# Altium schematic sheet power.SchDoc
size A4; SheetNumber: 4; SheetTotal: 4
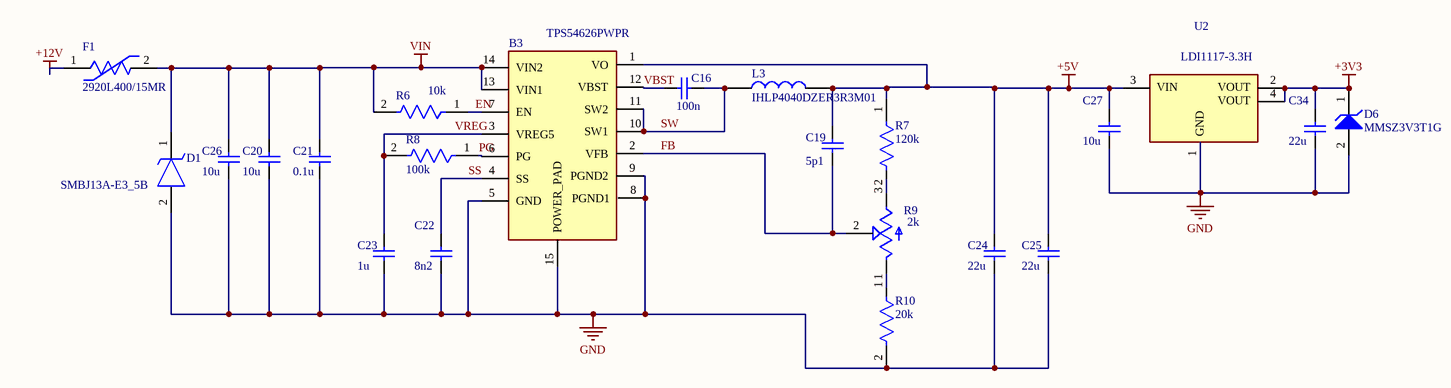
[diagram p0: power.SchDoc]

## Parts
B3  TPS54626PWPR  [TPS54626PWPR]
C16  100n  [CAPC1206(3216)150_L]
C19  5p1  [CAPC1206(3216)150_L]
C20  10u  [CAPC1206(3216)150_L]
C21  0.1u  [CAPC1206(3216)150_L]
C22  8n2  [CAPC1206(3216)150_L]
C23  1u  [CAPC1206(3216)150_L]
C24  22u  [CAPC1206(3216)150_L]
C25  22u  [CAPC1206(3216)150_L]
C26  10u  [CAPC1206(3216)150_L]
C27  10u  [CAPC1206(3216)150_L]
C34  22u  [CAPC1206(3216)150_L]
D1  SMBJ13A-E3_5B  [DIOM5436X244N]
D6  MMSZ3V3T1G  [ONSC-SOD-123-2-425-04_V]
F1  2920L400/15MR  [FP-2920L400-15MR-MFG]
L3  IHLP4040DZER3R3M01  [IHLP4040DZER3R3M01]
R6  10k  [FP-RK73H2B-MFG]
R7  120k  [FP-RK73H2B-MFG]
R8  100k  [FP-RK73H2B-MFG]
R9  2k  [TRIM_TC33X-2-503E]
R10  20k  [FP-RK73H2B-MFG]
U2  LDI1117-3.3H  [LDI1117-3.3H]

## Nets
+3V3: C34.1 D6.1(K) U2.2 U2.4
+5V: B3.1(VO) C19.1 C24.1 C25.1 C27.1 L3.2 R7.1 U2.3
+12V: F1.1
GND: B3.5(GND) B3.8(PGND1) B3.9(PGND2) B3.15(POWER_PAD) C20.2 C21.2 C22.2 C23.2 C24.2 C25.2 C26.2 C27.2 C34.2 D1.2(A) D6.2(A) R10.2 U2.1
VIN: B3.13(VIN1) B3.14(VIN2) C20.1 C21.1 C26.1 D1.1(K) F1.2 R6.2
EN: B3.7(EN) R6.1
FB: B3.2(VFB) C19.2 R9.2(W)
PG: B3.6(PG) R8.1
SS: B3.4(SS) C22.1
SW: B3.10(SW1) B3.11(SW2) C16.2 L3.1
VBST: B3.12(VBST) C16.1
VREG: B3.3(VREG5) C23.1 R8.2
NetR7_2: R7.2 R9.3(CW)
NetR9_1: R9.1(CCW) R10.1

## Notes on the sheet
- (in symbol LDI1117-3.3H) VIN; VOUT; GND

## Library data of the parts
B3 = TPS54626PWPR: 4.5-V to 18-V, 6.5-A synchronous buck converter with eco-mode in HTSSOP package 14-HTSSOP -40 to 85; Manufacturer_Name: Texas Instruments; Manufacturer Lifecycle Status: ACTIVE; Geometry.Height: 1.2mm; Max Supply Voltage: 18V; Max Junction Temperature (Tj): 150°C; Max Output current: 6.5A; Max Output Voltage: 5.5V; Min Input Voltage: 4.5V; Min Output Voltage: 765mV; Number of Outputs: 1; Output Configuration: Positive; Output Type: Adjustable; Quiescent Current: 950µA; Switching Frequency: 650kHz; Synchronous Rectifier: Yes; Manufacturer_Part_Number: TPS54626PWPR; Mouser Part Number: 595-TPS54626PWPR; Mouser Price/Stock: https://www.mouser.com/Search/Refine.aspx?Keyword=595-TPS54626PWPR; Arrow Part Number: TPS54626PWPR; Arrow Price/Stock: https://www.arrow.com/en/products/tps54626pwpr/texas-instruments; Datasheet Link: http://www.ti.com/lit/gpn/tps54626; Supplier: DigiKey; Supplier Part Number: 296-40807-1-ND; Manufacturer: Texas Instruments; Manufacturer Part Number: TPS54626PWPR; RoHS: Compliant; Category: Voltage Regulators - Switching; Stock: 2008; Pricing: 1=2,62, 10=1,949, 25=1,7824, 100=1,5986, 250=1,511, 500=1,45818, 1000=1,41471 (USD); Case/Package: SOP; Height: 1.2mm; Lead Free: Lead Free; Length: 5mm; Lifecycle Status: Production; Max Operating Temperature: 85°C; Min Operating Temperature: -40°C; Min Supply Voltage: 4.5V; Mounting Technology: Surface Mount; Pins: 14; Operating Supply Voltage: 18V; Output Current: 6.5A; Output Voltage: 5.5V; Packaging: Tape & Reel (TR); Radiation Hardening: No; Schedule B: 8542390000, 8542390000|8542390000|8542390000|8542390000|8542390000; Thickness: 1mm; Topology: Buck; Weight: 240.999296mg; Width: 4.4mm; ComponentLink1URL: https://sigma.octopart.com:443/159569814/technical_drawing/Texas-Instruments-TPS54626PWPR.pdf?src-supplier=Texas+Instruments; ComponentLink1Description: https://sigma.octopart.com:443/159569814/technical_drawing/Texas-Instruments-TPS54626PWPR.pdf?src-supplier=Texas+Instruments; ComponentLink2URL: https://octopart.com:443/opatz8j6/c1?t=junKIVYlBbJDuToYkP2u6iV_naOc3Ho3DaOgm-CZ1UNwzrO6Mwyt4_bqvjuo9VmmQwBrWZSgc4LMoLaqIUkSz1Xp0i9S1rGYecaLkVbwuYCFoHmPHRnGPZOeqL-psw5WJA7ukYFP-z3UDe3vNSZVHaSS5TxmzYc38o1a76CPyg8DfEPdGkibNetDDoh0UPz4M4fSBrk37deijP5Y4U2a4nCx67PN7G5YxWzDYRetJGeVH0J_jhwrCM2X4qBFoA_wruu_NjKBHA4DIZrHf9JZLVDCNqpVByfdRJxT7EWUiLr8Dj5AnH3Xy44ZP455MYbgrmSiHAkyMUWlRSGl12e9NFk8w0cDAeKGDR43UxISDxcxxqmRqcKUGnIReVBdDrWwUstg4jH0&src-supplier=Texas+Instruments; ComponentLink2Description: https://octopart.com:443/opatz8j6/c1?t=junKIVYlBbJDuToYkP2u6iV_naOc3Ho3DaOgm-CZ1UNwzrO6Mwyt4_bqvjuo9VmmQwBrWZSgc4LMoLaqIUkSz1Xp0i9S1rGYecaLkVbwuYCFoHmPHRnGPZOeqL-psw5WJA7ukYFP-z3UDe3vNSZVHaSS5TxmzYc38o1a76CPyg8DfEPdGkibNetDDoh0UPz4M4fSBrk37deijP5Y4U2a4nCx67PN7G5YxWzDYRetJGeVH0J_jhwrCM2X4qBFoA_wruu_NjKBHA4DIZrHf9JZLVDCNqpVByfdRJxT7EWUiLr8Dj5AnH3Xy44ZP455MYbgrmSiHAkyMUWlRSGl12e9NFk8w0cDAeKGDR43UxISDxcxxqmRqcKUGnIReVBdDrWwUstg4jH0&src-supplier=Texas+Instruments; ComponentLink3URL: https://datasheet.octopart.com:443/TPS54626PWPR-Texas-Instruments-datasheet-20674354.pdf?src-supplier=Texas+Instruments; ComponentLink3Description: https://datasheet.octopart.com:443/TPS54626PWPR-Texas-Instruments-datasheet-20674354.pdf?src-supplier=Texas+Instruments; ComponentLink4URL: https://datasheet.octopart.com:443/TPS54626PWPR-Texas-Instruments-datasheet-17275025.pdf?src-supplier=Texas+Instruments; ComponentLink4Description: https://datasheet.octopart.com:443/TPS54626PWPR-Texas-Instruments-datasheet-17275025.pdf?src-supplier=Texas+Instruments; ComponentLink5URL: https://sigma.octopart.com:443/49250594/technical_drawing/Texas-Instruments-TPS54626PWPR.pdf?src-supplier=Texas+Instruments; ComponentLink5Description: https://sigma.octopart.com:443/49250594/technical_drawing/Texas-Instruments-TPS54626PWPR.pdf?src-supplier=Texas+Instruments; ComponentLink6URL: https://datasheet.octopart.com:443/TPS54626PWPR-Texas-Instruments-datasheet-164392911.pdf?src-supplier=LCSC; ComponentLink6Description: https://datasheet.octopart.com:443/TPS54626PWPR-Texas-Instruments-datasheet-164392911.pdf?src-supplier=LCSC; ComponentLink7URL: https://datasheet.octopart.com:443/TPS54626PWPR-Texas-Instruments-datasheet-152588636.pdf?src-supplier=Arrow.cn; ComponentLink7Description: https://datasheet.octopart.com:443/TPS54626PWPR-Texas-Instruments-datasheet-152588636.pdf?src-supplier=Arrow.cn; ComponentLink8URL: https://datasheet.octopart.com:443/TPS54626PWPR-Texas-Instruments-datasheet-137316104.pdf?src-supplier=Future+Electronics; ComponentLink8Description: https://datasheet.octopart.com:443/TPS54626PWPR-Texas-Instruments-datasheet-137316104.pdf?src-supplier=Future+Electronics; ComponentLink9URL: http://sigma.octopart.com:80/reach_statement/Texas-Instruments-company-64.pdf?src-supplier=Compliance+Statements; ComponentLink9Description: http://sigma.octopart.com:80/reach_statement/Texas-Instruments-company-64.pdf?src-supplier=Compliance+Statements; ComponentLink10URL: http://sigma.octopart.com:80/conflict_mineral_statement/Texas-Instruments-company-63.pdf?src-supplier=Compliance+Statements; ComponentLink10Description: http://sigma.octopart.com:80/conflict_mineral_statement/Texas-Instruments-company-63.pdf?src-supplier=Compliance+Statements
C16 C19-C27 C34 = CMP-1037-04778-1: CAP 1.8uF 10V ±5% 1206 (3216 Metric) Thickness 1.45mm SMD; Case-EIA: 1206; Tolerance: Â±5%; Case-Metric: 3216; Technology: SMT; Value: 1.8uF; Rated Voltage: 10 V; Max Thickness: 1.45 mm
D1 = SMBJ13A-E3_5B: TVS Diode (Uni-directional); Manufacturer_Name: Vishay; Manufacturer_Part_Number: SMBJ13A-E3/5B; Datasheet Link: http://www.vishay.com/docs/88392/smbj.pdf; Height: 2.44mm; Mouser Part Number: 625-SMBJ13A-E3/5B; Mouser Price/Stock: https://www.mouser.co.uk/ProductDetail/Vishay-General-Semiconductor/SMBJ13A-E3-5B?qs=3qLEwsAJF5SlimqtZxBirg%3D%3D; Arrow Part Number: SMBJ13A-E3/5B; Arrow Price/Stock: https://www.arrow.com/en/products/smbj13a-e35b/vishay?utm_currency=USD&region=europe
D6 = CMP-1060-00515-1: Zener Voltage Regulator, 500 mW, 2-Pin SOD-123, Pb-Free, Tape and Reel; Manufacturer: On Semiconductor; P Max (W): 0.5; ComponentLink3URL: http://www.onsemi.com/pub_link/Collateral/425-04.PDF; ComponentLink2Description: Datasheet; DatasheetVersion: Rev. 11; ComponentLink1URL: http://www.onsemi.com/; PackageDescription: 2-Pin SOD, Body 1.6 x 2.69 mm; Mounting Technology: Surface Mount; ComponentLink3Description: Package Specification; ComponentLink1Description: Manufacturer URL; Packing: Tape and Reel; ComponentLink2URL: http://www.onsemi.com/pub_link/Collateral/MMSZ2V4T1-D.PDF; PartNumber: MMSZ3V3T1G; PackageReference: SOD-123-2-425-04; PackageVersion: Rev. G, 10/2009; RoHS: Pb-Free
F1 = CMP-08606-000010-2: PTC RESET FUSE 15V 4A 2920; Max Current Rating: 40A; Time to Trip: 4s; Trip Current: 8A; Approvals: TUV; Min Operating Temperature: -40°C; Packaging: Tape and Reel; Case Code (Metric): 7351; Hold Current: 4A; Max Operating Temperature: 85°C; Case Code (Imperial): 2920; Mount: Surface Mount
L3 = IHLP4040DZER3R3M01: Inductor High Current Shielded Wirewound 3.3uH 20% 100KHz 10A 11.8mOhm DCR 4040 T/R; Manufacturer_Name: Vishay; Geometry.Height: 4mm; Core Material: Composite; DC Resistance (DCR): 11.8mΩ; Value: 3.3µH; Max DC Current: 18.6A; Number of Circuits: 1; Self Resonant Frequency: 5MHz; ESR: 14.4mΩ; Shielding: Yes; Manufacturer_Part_Number: IHLP4040DZER3R3M01; Mouser Part Number: 70-IHLP4040DZER3R3M0; Mouser Price/Stock: https://www.mouser.co.uk/ProductDetail/Vishay-Dale/IHLP4040DZER3R3M01?qs=UUKq9QDXQ0nKJM%252B3xlQGHA%3D%3D; Arrow Part Number: IHLP4040DZER3R3M01; Arrow Price/Stock: https://www.arrow.com/en/products/ihlp4040dzer3r3m01/vishay?region=nac; Datasheet Link: https://www.vishay.com/docs/34193/ihlp-4040dz-01.pdf; Supplier: Farnell; Supplier Part Number: 1547037; Manufacturer: Vishay; Manufacturer Part Number: IHLP4040DZER3R3M01; RoHS: Compliant; Category: Fixed Inductors; Stock: 559; Case/Package: 4040; Case Code (Imperial): 4040; China RoHS: Compliant; Composition: Wirewound; Contact Plating: Tin; Current Rating: 10A; Depth: 10.3mm; Height: 4mm; Height - Seated (Max): 3.9878mm; Inductance Tolerance: 20%; Lead Free: Lead Free; Lifecycle Status: Production; Max Current Rating: 10A; Max Operating Temperature: 125°C; Military Standard: Not; Min Operating Temperature: -55°C; Mounting Technology: Surface Mount; Number of Terminals: 2; Radiation Hardening: No; REACH SVHC: Yes; RMS Current (Irms): 10A; Saturation Current: 18.6A; Schedule B: 8504500000, 8504500000|8504500000|8504500000|8504500000|8504500000; Termination: SMD/SMT; Test Frequency: 100kHz; Tolerance: 20%; Weight: 2.000002g; Width: 10.16mm; ComponentLink1URL: https://datasheet.octopart.com:443/IHLP4040DZER3R3M01-Vishay-datasheet-181468593.pdf?src-supplier=IHS; ComponentLink1Description: https://datasheet.octopart.com:443/IHLP4040DZER3R3M01-Vishay-datasheet-181468593.pdf?src-supplier=IHS; ComponentLink2URL: https://datasheet.octopart.com:443/IHLP4040DZER3R3M01-Vishay-Dale-datasheet-181465866.pdf?src-supplier=IHS; ComponentLink2Description: https://datasheet.octopart.com:443/IHLP4040DZER3R3M01-Vishay-Dale-datasheet-181465866.pdf?src-supplier=IHS; ComponentLink3URL: https://datasheet.octopart.com:443/IHLP4040DZER3R3M01-Vishay-datasheet-67039456.pdf?src-supplier=Farnell; ComponentLink3Description: https://datasheet.octopart.com:443/IHLP4040DZER3R3M01-Vishay-datasheet-67039456.pdf?src-supplier=Farnell; ComponentLink4URL: https://datasheet.octopart.com:443/IHLP4040DZER3R3M01-Vishay-datasheet-167142.pdf?src-supplier=Farnell; ComponentLink4Description: https://datasheet.octopart.com:443/IHLP4040DZER3R3M01-Vishay-datasheet-167142.pdf?src-supplier=Farnell; ComponentLink5URL: https://datasheet.octopart.com/IHLP4040DZER3R3M01-Vishay-datasheet-12542609.pdf; ComponentLink5Description: https://datasheet.octopart.com/IHLP4040DZER3R3M01-Vishay-datasheet-12542609.pdf; ComponentLink6URL: https://datasheet.octopart.com/IHLP4040DZER3R3M01-Vishay-datasheet-12537444.pdf; ComponentLink6Description: https://datasheet.octopart.com/IHLP4040DZER3R3M01-Vishay-datasheet-12537444.pdf; ComponentLink7URL: https://datasheet.octopart.com/IHLP4040DZER3R3M01-Vishay-datasheet-12514016.pdf; ComponentLink7Description: https://datasheet.octopart.com/IHLP4040DZER3R3M01-Vishay-datasheet-12514016.pdf; ComponentLink8URL: https://datasheet.octopart.com/IHLP4040DZER3R3M01-Vishay-datasheet-5394347.pdf; ComponentLink8Description: https://datasheet.octopart.com/IHLP4040DZER3R3M01-Vishay-datasheet-5394347.pdf; ComponentLink9URL: https://datasheet.octopart.com:443/IHLP4040DZER3R3M01-Vishay-datasheet-8434461.pdf?src-supplier=Newark; ComponentLink9Description: https://datasheet.octopart.com:443/IHLP4040DZER3R3M01-Vishay-datasheet-8434461.pdf?src-supplier=Newark; ComponentLink10URL: https://datasheet.octopart.com:443/IHLP4040DZER3R3M01-Vishay-datasheet-62320562.pdf?src-supplier=element14+APAC; ComponentLink10Description: https://datasheet.octopart.com:443/IHLP4040DZER3R3M01-Vishay-datasheet-62320562.pdf?src-supplier=element14+APAC; ComponentLink11URL: https://datasheet.octopart.com:443/IHLP4040DZER3R3M01-Vishay-datasheet-101783941.pdf?src-supplier=Future+Electronics; ComponentLink11Description: https://datasheet.octopart.com:443/IHLP4040DZER3R3M01-Vishay-datasheet-101783941.pdf?src-supplier=Future+Electronics; ComponentLink12URL: https://datasheet.octopart.com:443/IHLP4040DZER3R3M01-Vishay-datasheet-12531877.pdf?src-supplier=Future+Electronics; ComponentLink12Description: https://datasheet.octopart.com:443/IHLP4040DZER3R3M01-Vishay-datasheet-12531877.pdf?src-supplier=Future+Electronics; ComponentLink13URL: https://datasheet.octopart.com:443/IHLP4040DZER3R3M01-Vishay-Dale-datasheet-42936488.pdf?src-supplier=RS+(Formerly+Allied+Electronics); ComponentLink13Description: https://datasheet.octopart.com:443/IHLP4040DZER3R3M01-Vishay-Dale-datasheet-42936488.pdf?src-supplier=RS+(Formerly+Allied+Electronics); ComponentLink14URL: https://datasheet.octopart.com:443/IHLP4040DZER3R3M01-Vishay-datasheet-140572121.pdf?src-supplier=Arrow.cn; ComponentLink14Description: https://datasheet.octopart.com:443/IHLP4040DZER3R3M01-Vishay-datasheet-140572121.pdf?src-supplier=Arrow.cn; ComponentLink15URL: http://sigma.octopart.com:80/rohs_statement/Vishay-company-15.pdf?src-supplier=Compliance+Statements; ComponentLink15Description: http://sigma.octopart.com:80/rohs_statement/Vishay-company-15.pdf?src-supplier=Compliance+Statements
R6-R8 R10 = CMP-04015-098385-1: 40.2kΩ ±1% 0.25W Chip Resistor 1206 Thick Film AEC-Q200 Qualified; Resistance: 40.2kR; Voltage Rating (DC): 200V; Temperature Coefficient: 100ppm/°C; Power Rating: 250mW; Tolerance: 1%; Package Quantity: 5000; Length: 3.2mm; Termination: SMD/SMT; Lead Free: Contains Lead; Case Code (Imperial): 1206; Case/Package: 1206; Voltage Rating: 200V; Case Code (Metric): 3216; Max Operating Temperature: 155°C; Packaging: Tape and Reel; Width: 1.6mm; Series: RK73H; Min Operating Temperature: -55°C; RoHS Compliant: No; Height: 0.6mm
R9 = TC33X-2-503E: Adjustable Resistors – SMD; BOURNS; TC33X-2-503E; Cermet; 1.2 mm; 100 mW; Surface Mount; Max Power Dissipation: 100mW; Number of Turns: 1; Power Dissipation: 150mW; Temperature Coefficient: 250ppm/°C; Tolerance: 25%; Voltage Rating (DC): 50V; SnapEDA_Link: https://www.snapeda.com/parts/TC33X-2-503E/Bourns/view-part/467769/?ref=snap; Package: 1608 Bourns; MP: TC33X-2-503E; MF: Bourns; Value: *; Check_prices: https://www.snapeda.com/parts/TC33X-2-503E/Bourns/view-part/467769/?ref=eda; Digi-Key_Part_Number: TC33X-503ECT-ND; Purchase-URL: https://pricing.snapeda.com/search/part/TC33X-2-503E/?ref=eda; Supplier: DigiKey; Supplier Part Number: TC33X-503ECT-ND; Manufacturer: Bourns; Manufacturer Part Number: TC33X-2-503E; RoHS: Compliant; Category: Variable Resistors and Potentiometers; Stock: 2932; Pricing: 1=0,25, 10=0,213, 25=0,1996, 50=0,1896, 100=0,18, 250=0,168, 500=0,15938, 1000=0,15119 (USD); Color: Silver; Composition: Cermet; Depth: 3.8mm; Height: 1.2mm; Lead Free: Contains Lead; Length: 3.8mm; Lifecycle Status: Production; Max Operating Temperature: 100°C; Military Standard: Not; Min Operating Temperature: -40°C; Mounting Technology: Surface Mount; Number of Terminals: 3; Packaging: Cut Tape; Power Rating: 100mW; Radiation Hardening: No; REACH SVHC: Yes; Schedule B: 8533400080, 8533400080|8533400080|8533400080|8533400080|8533400080; Termination: Foot Print; Weight: 29.4mg; Width: 3.6mm; Working Voltage: 50V; ComponentLink1URL: https://datasheet.octopart.com:443/TC33X-2-503E-Bourns-datasheet-182142024.pdf?src-supplier=IHS; ComponentLink1Description: https://datasheet.octopart.com:443/TC33X-2-503E-Bourns-datasheet-182142024.pdf?src-supplier=IHS; ComponentLink2URL: https://datasheet.octopart.com:443/TC33X-2-503E-Bourns-datasheet-11551316.pdf?src-supplier=Electro+Sonic; ComponentLink2Description: https://datasheet.octopart.com:443/TC33X-2-503E-Bourns-datasheet-11551316.pdf?src-supplier=Electro+Sonic; ComponentLink3URL: https://datasheet.octopart.com:443/TC33X-2-503E-Bourns-datasheet-154730028.pdf?src-supplier=Electro+Sonic; ComponentLink3Description: https://datasheet.octopart.com:443/TC33X-2-503E-Bourns-datasheet-154730028.pdf?src-supplier=Electro+Sonic; ComponentLink4URL: https://datasheet.octopart.com:443/TC33X-2-503E-Bourns-datasheet-67039831.pdf?src-supplier=element14+APAC; ComponentLink4Description: https://datasheet.octopart.com:443/TC33X-2-503E-Bourns-datasheet-67039831.pdf?src-supplier=element14+APAC; ComponentLink5URL: https://datasheet.octopart.com:443/TC33X-2-503E-Bourns-datasheet-164917123.pdf?src-supplier=Newark; ComponentLink5Description: https://datasheet.octopart.com:443/TC33X-2-503E-Bourns-datasheet-164917123.pdf?src-supplier=Newark; ComponentLink6URL: https://datasheet.octopart.com:443/TC33X-2-503E-Bourns-datasheet-26822215.pdf?src-supplier=Newark; ComponentLink6Description: https://datasheet.octopart.com:443/TC33X-2-503E-Bourns-datasheet-26822215.pdf?src-supplier=Newark; ComponentLink7URL: https://datasheet.octopart.com:443/TC33X-2-503E-Bourns-datasheet-41964919.pdf?src-supplier=Newark; ComponentLink7Description: https://datasheet.octopart.com:443/TC33X-2-503E-Bourns-datasheet-41964919.pdf?src-supplier=Newark; ComponentLink8URL: https://datasheet.octopart.com:443/TC33X-2-503E-Bourns-datasheet-47549324.pdf?src-supplier=RS+(Formerly+Allied+Electronics); ComponentLink8Description: https://datasheet.octopart.com:443/TC33X-2-503E-Bourns-datasheet-47549324.pdf?src-supplier=RS+(Formerly+Allied+Electronics); ComponentLink9URL: https://datasheet.octopart.com:443/TC33X-2-503E-Bourns-datasheet-549861.pdf?src-supplier=RS+(Formerly+Allied+Electronics); ComponentLink9Description: https://datasheet.octopart.com:443/TC33X-2-503E-Bourns-datasheet-549861.pdf?src-supplier=RS+(Formerly+Allied+Electronics); ComponentLink10URL: https://datasheet.octopart.com:443/TC33X-2-503E-Bourns-datasheet-21366158.pdf?src-supplier=Farnell; ComponentLink10Description: https://datasheet.octopart.com:443/TC33X-2-503E-Bourns-datasheet-21366158.pdf?src-supplier=Farnell; ComponentLink11URL: https://datasheet.octopart.com:443/TC33X-2-503E-Bourns-datasheet-38800.pdf?src-supplier=Farnell; ComponentLink11Description: https://datasheet.octopart.com:443/TC33X-2-503E-Bourns-datasheet-38800.pdf?src-supplier=Farnell; ComponentLink12URL: https://datasheet.octopart.com:443/TC33X-2-503E-Bourns-datasheet-5319878.pdf?src-supplier=element14; ComponentLink12Description: https://datasheet.octopart.com:443/TC33X-2-503E-Bourns-datasheet-5319878.pdf?src-supplier=element14; ComponentLink13URL: https://datasheet.octopart.com:443/TC33X-2-503E-Bourns-datasheet-14175263.pdf?src-supplier=iiiC; ComponentLink13Description: https://datasheet.octopart.com:443/TC33X-2-503E-Bourns-datasheet-14175263.pdf?src-supplier=iiiC; ComponentLink14URL: https://datasheet.octopart.com:443/TC33X-2-503E-Bourns-datasheet-39003.pdf?src-supplier=Mouser; ComponentLink14Description: https://datasheet.octopart.com:443/TC33X-2-503E-Bourns-datasheet-39003.pdf?src-supplier=Mouser; ComponentLink15URL: http://sigma.octopart.com:80/conflict_mineral_statement/Bourns-company-36.pdf?src-supplier=Compliance+Statements; ComponentLink15Description: http://sigma.octopart.com:80/conflict_mineral_statement/Bourns-company-36.pdf?src-supplier=Compliance+Statements
U2 = LDI1117-3.3H: Fixed Positive LDO Regulator; Manufacturer: Diotec; Supplier: Mouser; Supplier Part Number: 637-LDI1117-3.3H; Manufacturer Part Number: LDI1117-3.3H; RoHS: No; Category: Voltage Regulators - Linear; Stock: 5056; Pricing: 1=0,4, 10=0,286, 50=0,286, 100=0,199, 1000=0,163, 10000=0,089 (USD); ComponentLink1URL: https://datasheet.octopart.com/LDI1117-3.3H-Diotec-datasheet-154607892.pdf?src-supplier=TME; ComponentLink1Description: https://datasheet.octopart.com/LDI1117-3.3H-Diotec-datasheet-154607892.pdf?src-supplier=TME; ComponentLink2URL: https://datasheet.octopart.com/LDI1117-3.3H-Diotec-datasheet-159101088.pdf?src-supplier=SOS+electronic; ComponentLink2Description: https://datasheet.octopart.com/LDI1117-3.3H-Diotec-datasheet-159101088.pdf?src-supplier=SOS+electronic; ComponentLink3URL: https://datasheet.octopart.com/LDI1117-3.3H-Diotec-datasheet-189099648.pdf?src-supplier=Master+Electronics; ComponentLink3Description: https://datasheet.octopart.com/LDI1117-3.3H-Diotec-datasheet-189099648.pdf?src-supplier=Master+Electronics